# Altium schematic sheet Microcontroller.SchDoc
size A4
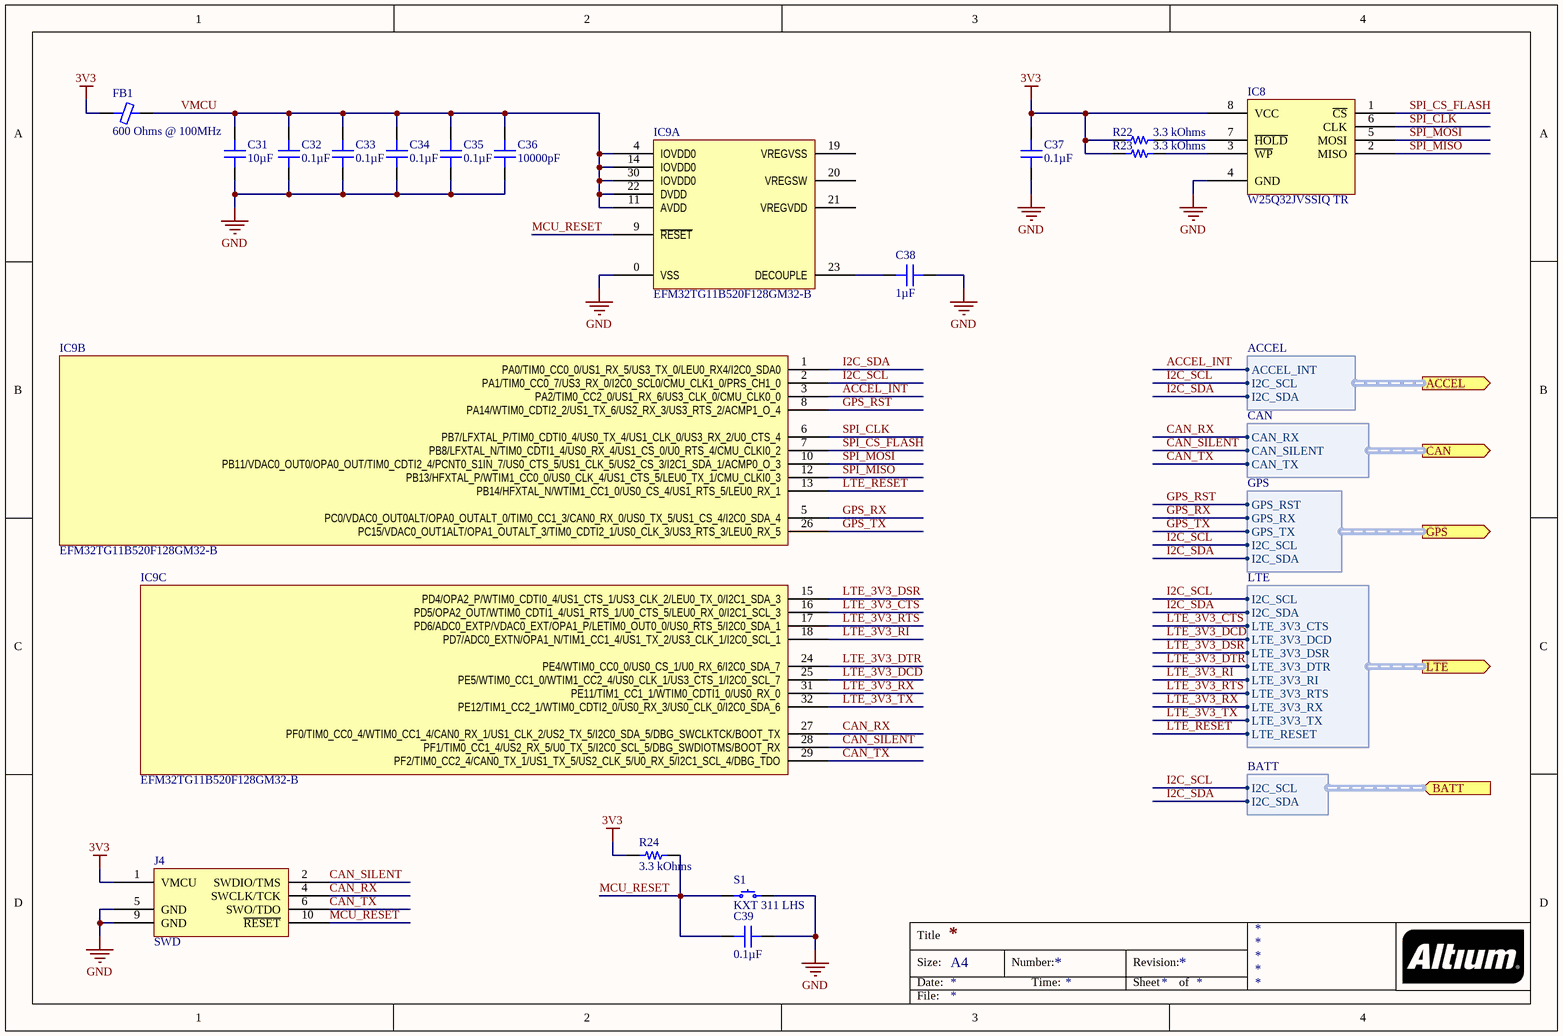
[diagram p0: Microcontroller.SchDoc]

## Parts
C31  10µF  [CAP 0402_1005]
C32  0.1µF  [CAP 0201_0603]
C33  0.1µF  [CAP 0201_0603]
C34  0.1µF  [CAP 0201_0603]
C35  0.1µF  [CAP 0201_0603]
C36  10000pF  [CAP 0201_0603]
C37  0.1µF  [CAP 0201_0603]
C38  1µF  [CAP 0402_1005]
C39  0.1µF  [CAP 0201_0603]
FB1  600 Ohms @ 100MHz  [FER 0402_1005]
IC8  W25Q32JVSSIQ TR  [WINBOND SOIC-8 208MIL WIDE]
IC9  EFM32TG11B520F128GM32-B  [SI LABS QFN-32(5x5)]  (parts A,B,C of 3)
J4  SWD  [10 Pin SWD]  (no BOM)
R22  3.3 kOhms  [RES 0201_0603]
R23  3.3 kOhms  [RES 0201_0603]
R24  3.3 kOhms  [RES 0201_0603]
S1  KXT 311 LHS  [C&K KXT3]

## Ports
ACCEL (out, harness ACCEL), BATT (in, harness BATT), CAN (out, harness CAN), GPS (out, harness GPS), LTE (out, harness LTE)

## Harnesses
ACCEL: ACCEL_INT, I2C_SCL, I2C_SDA
CAN: CAN_RX, CAN_SILENT, CAN_TX
GPS: GPS_RST, GPS_RX, GPS_TX, I2C_SCL, I2C_SDA
LTE: I2C_SCL, I2C_SDA, LTE_3V3_CTS, LTE_3V3_DCD, LTE_3V3_DSR, LTE_3V3_DTR, LTE_3V3_RI, LTE_3V3_RTS, LTE_3V3_RX, LTE_3V3_TX, LTE_RESET
BATT: I2C_SCL, I2C_SDA

## Nets
3V3: C37.2 FB1.1 IC8.8(VCC) J4.1(VMCU) R22.2 R23.2 R24.2
GND: C31.1 C32.1 C33.1 C34.1 C35.1 C36.1 C37.1 C38.2 C39.1 IC8.4(GND) IC9.0(VSS) J4.5(GND) J4.9(GND) S1.2
ACCEL_INT: IC9.3(PA2/TIM0_CC2_0/US1_RX_6/US3_CLK_0/CMU_CLK0_0) ; port ACCEL.ACCEL_INT
CAN_RX: IC9.27(PF0/TIM0_CC0_4/WTIM0_CC1_4/CAN0_RX_1/US1_CLK_2/US2_TX_5/I2C0_SDA_5/DBG_SWCLKTCK/BOOT_TX) J4.4(SWCLK/TCK) ; port CAN.CAN_RX
CAN_SILENT: IC9.28(PF1/TIM0_CC1_4/US2_RX_5/U0_TX_5/I2C0_SCL_5/DBG_SWDIOTMS/BOOT_RX) J4.2(SWDIO/TMS) ; port CAN.CAN_SILENT
CAN_TX: IC9.29(PF2/TIM0_CC2_4/CAN0_TX_1/US1_TX_5/US2_CLK_5/U0_RX_5/I2C1_SCL_4/DBG_TDO) J4.6(SWO/TDO) ; port CAN.CAN_TX
GPS_RST: IC9.8(PA14/WTIM0_CDTI2_2/US1_TX_6/US2_RX_3/US3_RTS_2/ACMP1_O_4) ; port GPS.GPS_RST
GPS_RX: IC9.5(PC0/VDAC0_OUT0ALT/OPA0_OUTALT_0/TIM0_CC1_3/CAN0_RX_0/US0_TX_5/US1_CS_4/I2C0_SDA_4) ; port GPS.GPS_RX
GPS_TX: IC9.26(PC15/VDAC0_OUT1ALT/OPA1_OUTALT_3/TIM0_CDTI2_1/US0_CLK_3/US3_RTS_3/LEU0_RX_5) ; port GPS.GPS_TX
I2C_SCL: IC9.2(PA1/TIM0_CC0_7/US3_RX_0/I2C0_SCL0/CMU_CLK1_0/PRS_CH1_0) ; port ACCEL.I2C_SCL, port GPS.I2C_SCL, port LTE.I2C_SCL, port BATT.I2C_SCL
I2C_SDA: IC9.1(PA0/TIM0_CC0_0/US1_RX_5/US3_TX_0/LEU0_RX4/I2C0_SDA0) ; port ACCEL.I2C_SDA, port GPS.I2C_SDA, port LTE.I2C_SDA, port BATT.I2C_SDA
LTE_3V3_CTS: IC9.16(PD5/OPA2_OUT/WTIM0_CDTI1_4/US1_RTS_1/U0_CTS_5/LEU0_RX_0/I2C1_SCL_3) ; port LTE.LTE_3V3_CTS
LTE_3V3_DCD: IC9.25(PE5/WTIM0_CC1_0/WTIM1_CC2_4/US0_CLK_1/US3_CTS_1/I2C0_SCL_7) ; port LTE.LTE_3V3_DCD
LTE_3V3_DSR: IC9.15(PD4/OPA2_P/WTIM0_CDTI0_4/US1_CTS_1/US3_CLK_2/LEU0_TX_0/I2C1_SDA_3) ; port LTE.LTE_3V3_DSR
LTE_3V3_DTR: IC9.24(PE4/WTIM0_CC0_0/US0_CS_1/U0_RX_6/I2C0_SDA_7) ; port LTE.LTE_3V3_DTR
LTE_3V3_RI: IC9.18(PD7/ADC0_EXTN/OPA1_N/TIM1_CC1_4/US1_TX_2/US3_CLK_1/I2C0_SCL_1) ; port LTE.LTE_3V3_RI
LTE_3V3_RTS: IC9.17(PD6/ADC0_EXTP/VDAC0_EXT/OPA1_P/LETIM0_OUT0_0/US0_RTS_5/I2C0_SDA_1) ; port LTE.LTE_3V3_RTS
LTE_3V3_RX: IC9.31(PE11/TIM1_CC1_1/WTIM0_CDTI1_0/US0_RX_0) ; port LTE.LTE_3V3_RX
LTE_3V3_TX: IC9.32(PE12/TIM1_CC2_1/WTIM0_CDTI2_0/US0_RX_3/US0_CLK_0/I2C0_SDA_6) ; port LTE.LTE_3V3_TX
LTE_RESET: IC9.13(PB14/HFXTAL_N/WTIM1_CC1_0/US0_CS_4/US1_RTS_5/LEU0_RX_1) ; port LTE.LTE_RESET
MCU_RESET: C39.2 IC9.9(~{RESET}) J4.10(~{RESET}) R24.1 S1.1
SPI_CLK: IC8.6(CLK) IC9.6(PB7/LFXTAL_P/TIM0_CDTI0_4/US0_TX_4/US1_CLK_0/US3_RX_2/U0_CTS_4)
SPI_CS_FLASH: IC8.1(~{CS}) IC9.7(PB8/LFXTAL_N/TIM0_CDTI1_4/US0_RX_4/US1_CS_0/U0_RTS_4/CMU_CLKI0_2)
SPI_MISO: IC8.2(MISO) IC9.12(PB13/HFXTAL_P/WTIM1_CC0_0/US0_CLK_4/US1_CTS_5/LEU0_TX_1/CMU_CLKI0_3)
SPI_MOSI: IC8.5(MOSI) IC9.10(PB11/VDAC0_OUT0/OPA0_OUT/TIM0_CDTI2_4/PCNT0_S1IN_7/US0_CTS_5/US1_CLK_5/US2_CS_3/I2C1_SDA_1/ACMP0_O_3)
VMCU: C31.2 C32.2 C33.2 C34.2 C35.2 C36.2 FB1.2 IC9.4(IOVDD0) IC9.11(AVDD) IC9.14(IOVDD0) IC9.22(DVDD) IC9.30(IOVDD0)
NetC38_1: C38.1 IC9.23(DECOUPLE)
NetIC8_3: IC8.3(~{WP}) R23.1
NetIC8_7: IC8.7(~{HOLD}) R22.1

Not connected (* = marked no-connect by the designer): IC9 19(VREGVSS) 20(VREGSW) 21(VREGVDD)

## Notes on the sheet
- Title
- Size:
- Date:
- A4
- Number:
- Time:
- Revision:
- Sheet
- of
- File:

## Library data of the parts
C31 = GRM155R60J106ME15D: CAP CER 10UF 6.3V X5R 0402; Manufacturer: Murata Electronics; Tolerance: ±20%; Part Number: GRM155R60J106ME15D; Value: 10µF; Applications: General Purpose; Capacitance: 10µF; ComponentLink1Description: Datasheet; ComponentLink1URL: https://www.murata.com/~/media/webrenewal/support/library/catalog/products/capacitor/mlcc/c02e.ashx?la=en-us; ComponentLink2Description: DigiKey Link; ComponentLink2URL: http://digikey.com/product-detail/en/murata-electronics/GRM155R60J106ME15D/490-13238-1-ND/5877446; Device Package: 0402 (1005 Metric); LastUpdated: 01/04/2020 23:56:51; Lifecycle Status: Active; Minimum Order: 1; Mounting Type: Surface Mount, MLCC; Operating Temperature: -55°C ~ 85°C; Package / Case: 0402 (1005 Metric); Packaging: TapeAndReel; PartId: 6754; Part Status: Active; Price: 0.03; Series: GRM; Size / Dimension: 0.039" L x 0.020" W (1.00mm x 0.50mm); Supplier 1: DigiKey; Supplier Part Number 1: 490-13238-1-ND; Temperature Coefficient: X5R; Thickness (Max): 0.026" (0.65mm); Voltage - Rated: 6.3V
C32-C35 C37 C39 = GRM033R61C104ME84D: CAP CER 0.1UF 16V X5R 0201; Manufacturer: Murata Electronics; Tolerance: ±20%; Part Number: GRM033R61C104ME84D; Value: 0.1µF; Applications: General Purpose; Capacitance: 0.1µF; ComponentLink1Description: Datasheet; ComponentLink1URL: https://search.murata.co.jp/Ceramy/image/img/A01X/G101/ENG/GRM033R61C104ME84-01.pdf; ComponentLink2Description: DigiKey Link; ComponentLink2URL: http://digikey.com/product-detail/en/murata-electronics/GRM033R61C104ME84D/490-9986-1-ND/5026291; Device Package: 0201 (0603 Metric); LastUpdated: 21/01/2020 00:00:12; Lifecycle Status: Active; Minimum Order: 1; Mounting Type: Surface Mount, MLCC; Operating Temperature: -55°C ~ 85°C; Package / Case: 0201 (0603 Metric); Packaging: TapeAndReel; PartId: 1522; Part Status: Active; Price: 0.01; Series: GRM; Size / Dimension: 0.024" L x 0.012" W (0.60mm x 0.30mm); Supplier 1: DigiKey; Supplier Part Number 1: 490-9986-1-ND; Temperature Coefficient: X5R; Thickness (Max): 0.013" (0.33mm); Voltage - Rated: 16V
C36 = CGA1A2X7R0J103M030BA: CAP CER 10000PF 6.3V X7R 0201; Manufacturer: TDK Corporation; Tolerance: ±20%; Part Number: CGA1A2X7R0J103M030BA; Value: 10000pF; Applications: Automotive; Capacitance: 10000pF; ComponentLink1Description: Datasheet; ComponentLink1URL: https://product.tdk.com/info/en/catalog/datasheets/mlcc_automotive_general_en.pdf?ref_disty=digikey; ComponentLink2Description: DigiKey Link; ComponentLink2URL: http://digikey.com/product-detail/en/tdk-corporation/CGA1A2X7R0J103M030BA/445-12116-1-ND/3953782; Device Package: 0201 (0603 Metric); LastUpdated: 21/01/2020 00:00:11; Lifecycle Status: Active; Minimum Order: 1; Mounting Type: Surface Mount, MLCC; Operating Temperature: -55°C ~ 125°C; Package / Case: 0201 (0603 Metric); Packaging: TapeAndReel; PartId: 1683; Part Status: Active; Price: 0.01; Ratings: AEC-Q200; Series: CGA; Size / Dimension: 0.024" L x 0.012" W (0.60mm x 0.30mm); Supplier 1: DigiKey; Supplier Part Number 1: 445-12116-1-ND; Temperature Coefficient: X7R; Thickness (Max): 0.013" (0.33mm); Voltage - Rated: 6.3V
C38 = JMK105C6105KV-F: CAP CER 1UF 6.3V X6S 0402; Manufacturer: Taiyo Yuden; Tolerance: ±10%; Part Number: JMK105C6105KV-F; Value: 1µF; Applications: General Purpose; Capacitance: 1µF; ComponentLink1Description: Datasheet; ComponentLink1URL: https://www.yuden.co.jp/productdata/catalog/mlcc01_e.pdf; ComponentLink2Description: DigiKey Link; ComponentLink2URL: http://digikey.com/product-detail/en/taiyo-yuden/JMK105C6105KV-F/587-3381-1-ND/4157200; Device Package: 0402 (1005 Metric); LastUpdated: 01/04/2020 23:56:34; Lifecycle Status: Active; Minimum Order: 1; Mounting Type: Surface Mount, MLCC; Operating Temperature: -55°C ~ 105°C; Package / Case: 0402 (1005 Metric); Packaging: TapeAndReel; PartId: 12563; Part Status: Active; Price: 0.01; Series: M; Size / Dimension: 0.039" L x 0.020" W (1.00mm x 0.50mm); Supplier 1: DigiKey; Supplier Part Number 1: 587-3381-1-ND; Temperature Coefficient: X6S; Thickness (Max): 0.022" (0.55mm); Voltage - Rated: 6.3V
FB1 = BLM15PX601SZ1D: FERRITE BEAD 600 OHM 0402 1LN; Manufacturer: Murata Electronics; Current Rating (Max): 900mA; DC Resistance (DCR) (Max): 230mOhm; Filter Type: Power Line; Number of Lines: 1; Part Number: BLM15PX601SZ1D; ComponentLink1Description: Datasheet; ComponentLink1URL: https://www.murata.com/en-us/products/productdata/8796748677150/QNFA9118.pdf; ComponentLink2Description: DigiKey Link; ComponentLink2URL: http://digikey.com/product-detail/en/murata-electronics/BLM15PX601SZ1D/490-16655-1-ND/7595577; Device Package: 0402 (1005 Metric); Height (Max): 0.022" (0.55mm); Impedance @ Frequency: 600 Ohms @ 100MHz; LastUpdated: 21/01/2020 02:26:14; Lifecycle Status: Active; Minimum Order: 1; Mounting Type: Surface Mount; Operating Temperature: -55°C ~ 125°C; Package / Case: 0402 (1005 Metric); Packaging: TapeAndReel; PartId: 191; Part Status: Active; Price: 0.03; Ratings: AEC-Q200; Series: BLM; Size / Dimension: 0.039" L x 0.022" W (1.00mm x 0.55mm); Supplier 1: DigiKey; Supplier Part Number 1: 490-16655-1-ND; Value: 600 Ohms @ 100MHz
IC8 = W25Q32JVSSIQ TR: IC FLASH 32M SPI 133MHZ 8SOIC; Manufacturer: Winbond Electronics; Memory Interface: SPI - Quad I/O; Memory Size: 32Mb (4M x 8); Memory Type: Non-Volatile; Voltage - Supply: 2.7V ~ 3.6V; Write Cycle Time - Word, Page: 3ms; Part Number: W25Q32JVSSIQ TR; Clock Frequency: 133MHz; ComponentLink1Description: Datasheet; ComponentLink1URL: http://www.winbond.com/resource-files/w25q32jv%20revg%2003272018%20plus.pdf; ComponentLink2Description: DigiKey Link; ComponentLink2URL: http://digikey.com/product-detail/en/winbond-electronics/W25Q32JVSSIQ-TR/W25Q32JVSSIQCT-ND/7393546; Device Package: 8-SOIC (0.209", 5.30mm Width); LastUpdated: 30/03/2020 15:35:36; Lifecycle Status: Active; Memory Format: FLASH; Minimum Order: 1; Mounting Type: Surface Mount; Operating Temperature: -40°C ~ 85°C (TA); Package / Case: 8-SOIC (0.209", 5.30mm Width); Packaging: TapeAndReel; PartId: 857; Part Status: Active; Price: 0.54; Series: SpiFlash®; Supplier 1: DigiKey; Supplier Part Number 1: W25Q32JVSSIQCT-ND; Supplier Device Package: 8-SOIC; Technology: FLASH - NOR
IC9 = EFM32TG11B520F128GM32-B: LOW PWR MCU CORTEX-M0+ QFN32 128; Manufacturer: Silicon Labs; Connectivity: CANbus, I²C, IrDA, LINbus, SmartCard, SPI, UART/USART; Core Processor: ARM® Cortex®-M0+; Core Size: 32-Bit; Data Converters: A/D 12bit SAR; D/A 12bit; Number of I/O: 22; Oscillator Type: Internal; Peripherals: Brown-out Detect/Reset, DMA, I²S, POR, PWM, WDT; Program Memory Size: 128KB (128K x 8); Program Memory Type: FLASH; RAM Size: 32K x 8; Speed: 48MHz; Voltage - Supply (Vcc/Vdd): 1.8V ~ 3.8V; Part Number: EFM32TG11B520F128GM32-B; ComponentLink1Description: Datasheet; ComponentLink1URL: https://www.silabs.com/documents/public/data-sheets/efm32tg11-datasheet.pdf; ComponentLink2Description: DigiKey Link; ComponentLink2URL: http://digikey.com/product-detail/en/silicon-labs/EFM32TG11B520F128GM32-B/336-5690-ND/9677682; Device Package: 32-WFQFN Exposed Pad; LastUpdated: 30/03/2020 15:34:59; Lifecycle Status: Active; Minimum Order: 1; Mounting Type: Surface Mount; Operating Temperature: -40°C ~ 85°C (TA); Package / Case: 32-WFQFN Exposed Pad; Packaging: Tray; PartId: 197; Part Status: Active; Price: 2.06; Series: Tiny Gecko 1; Supplier 1: DigiKey; Supplier Part Number 1: 336-5690-ND; Supplier Device Package: 32-QFN (5x5)
R22-R24 = ERJ-1GNF3301C: RES SMD 3.3K OHM 1% 1/20W 0201; Manufacturer: Panasonic Electronic Components; Power (Watts): 0.05W, 1/20W; Temperature Coefficient: ±200ppm/°C; Part Number: ERJ-1GNF3301C; Value: 3.3 kOhms; ComponentLink1Description: Datasheet; ComponentLink1URL: https://industrial.panasonic.com/cdbs/www-data/pdf/RDA0000/AOA0000C304.pdf; ComponentLink2Description: DigiKey Link; ComponentLink2URL: http://digikey.com/product-detail/en/panasonic-electronic-components/ERJ-1GNF3301C/P122937CT-ND/8342813; Composition: Thick Film; Device Package: 0201 (0603 Metric); Features: Automotive AEC-Q200; Height - Seated (Max): 0.010" (0.26mm); LastUpdated: 21/01/2020 00:04:10; Lifecycle Status: Active; Minimum Order: 1; Number of Terminations: 2; Operating Temperature: -55°C ~ 125°C; Package / Case: 0201 (0603 Metric); Packaging: TapeAndReel; PartId: 4142; Part Status: Active; Price: 0.01; Ratings: AEC-Q200; Resistance: 3.3 kOhms; Series: ERJ; Size / Dimension: 0.024" L x 0.012" W (0.60mm x 0.30mm); Supplier 1: DigiKey; Supplier Part Number 1: P122937CT-ND; Supplier Device Package: 0201; Tolerance: ±1%
S1 = KXT 311 LHS: SWITCH TACTILE SPST-NO 0.02A 15V; Manufacturer: C&K; Actuator Height off PCB, Vertical: 0.60mm; Actuator Orientation: Top Actuated; Actuator Type: Standard; Contact Rating @ Voltage: 0.02A @ 15VDC; Illumination: Non-Illuminated; Operating Force: 100gf; Outline: 3.00mm x 2.00mm; Switch Function: Off-Mom; Part Number: KXT 311 LHS; Circuit: SPST-NO; ComponentLink1Description: Datasheet; ComponentLink1URL: https://dznh3ojzb2azq.cloudfront.net/products/Tactile/KXT3/documents/datasheet.pdf; ComponentLink2Description: DigiKey Link; ComponentLink2URL: http://digikey.com/product-detail/en/c-k/KXT-311-LHS/CKN10777CT-ND/6599755; LastUpdated: 25/01/2020 19:35:40; Lifecycle Status: Active; Minimum Order: 1; Mounting Type: Surface Mount; Operating Temperature: -40°C ~ 85°C; Packaging: TapeAndReel; Part Status: Active; Price: 0.11; Series: KXT3; Supplier 1: DigiKey; Supplier Part Number 1: CKN10777CT-ND; Termination Style: SMD (SMT) Tab